# EAGLE design rj45-breakout-10.5.0 (EAGLE 9.6.1)
Assembly variants: NO_NMEA

## Sheet 1 of 2
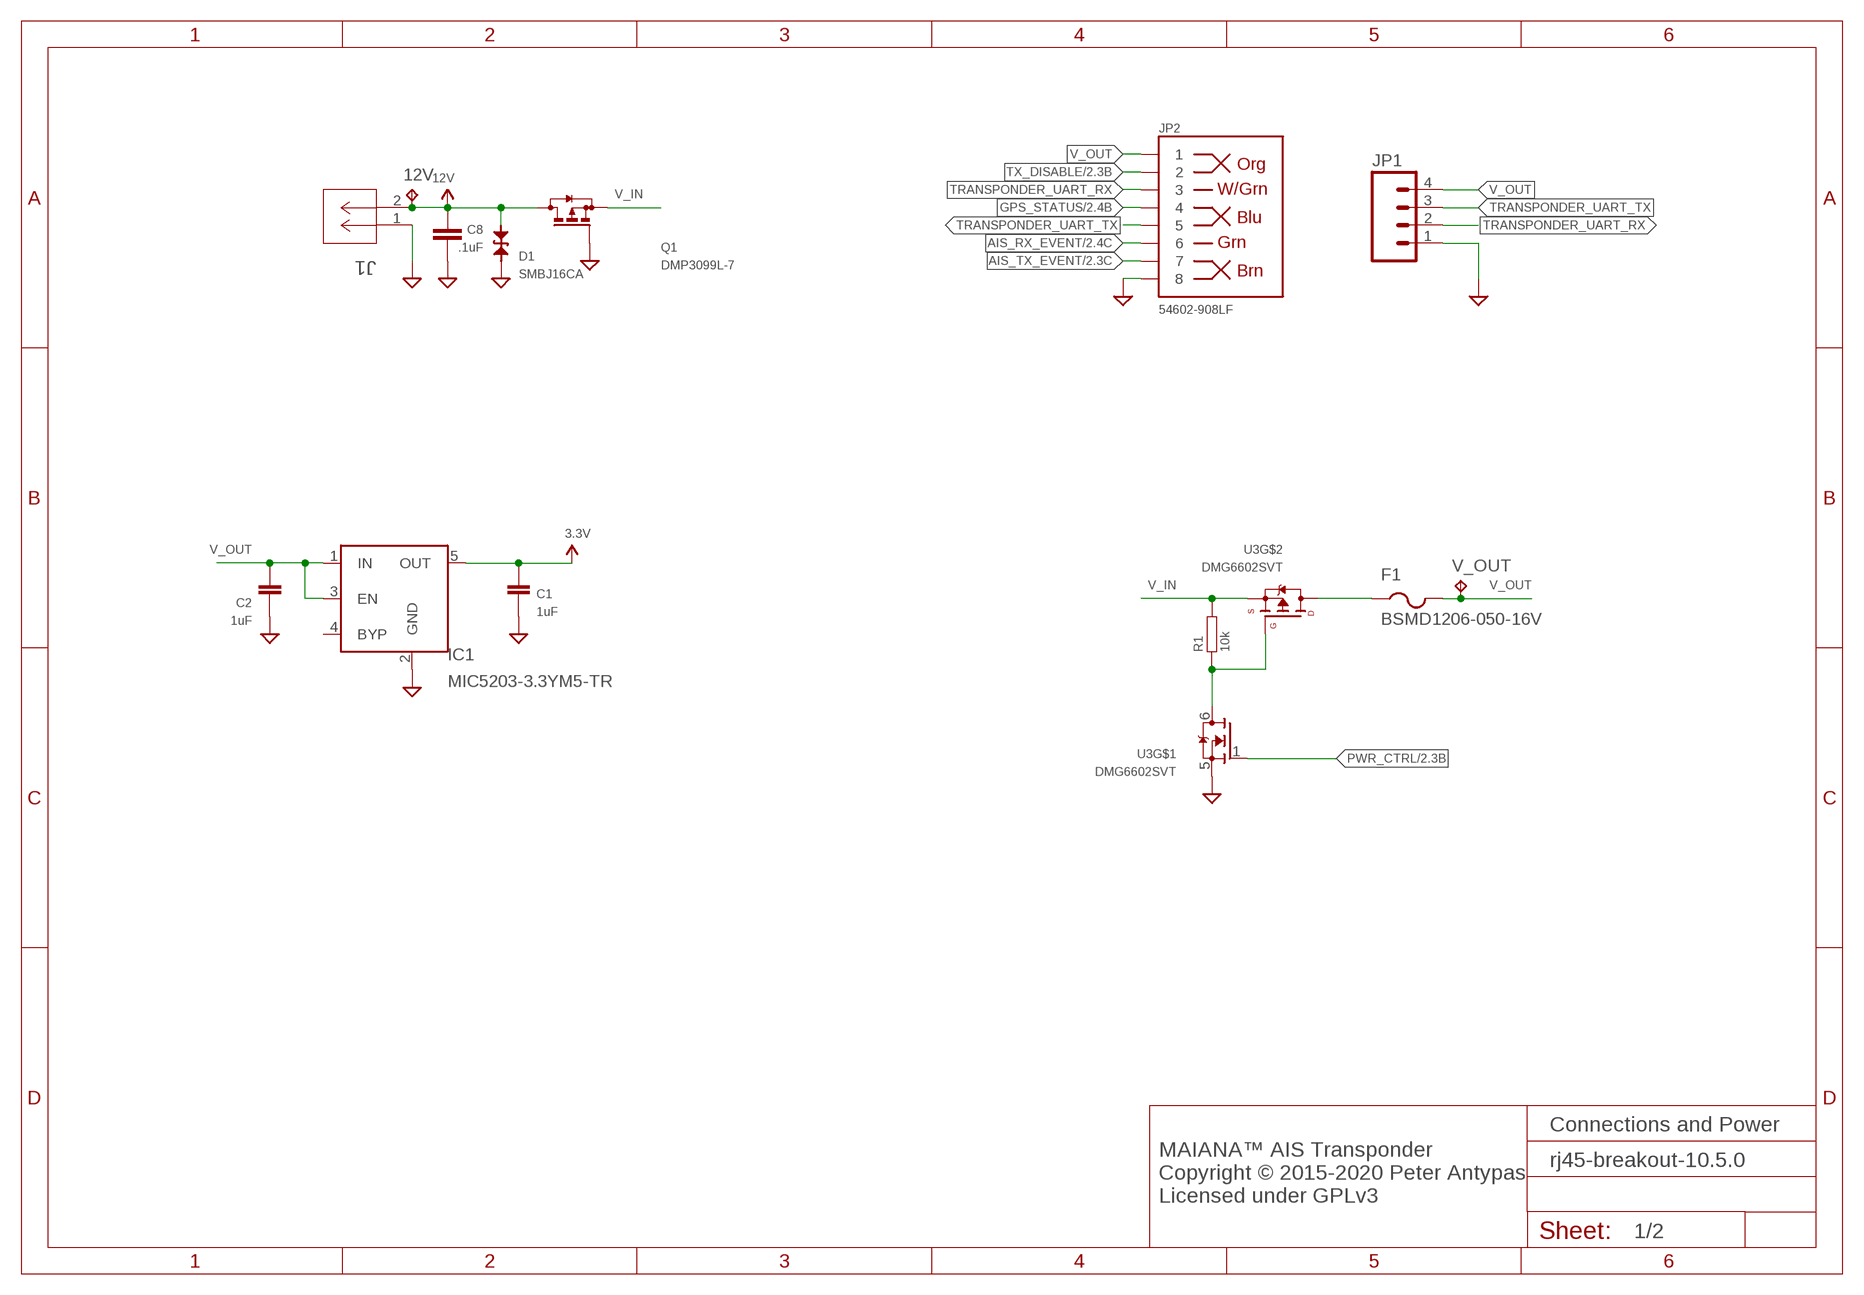
[diagram p0: schematic, sheet 1]

### Parts
12V  TPTP20R  [TP20R]
C1  1uF  CAPACITOR0603  [0603]
C2  1uF  CAPACITOR0603  [0603]
C8  .1uF  CAP0603-CAP  [0603-CAP]
D1  SMBJ16CA  DIODE-TVS-BIDIRSMB  [SMB-BIDIR]
F1  BSMD1206-050-16V  PTCFUSE-1206  [R1206]
IC1  MIC5203-3.3YM5-TR  MIC5219XX  [SOT23-5]
J1  OSTVN02A150  [CONN_OSTVN02A150_OST]
JP1  M04PTH  [1X04]
JP2  54602-908LF  RJ45-8PTH  [RJ45-8]
Q1  DMP3099L-7  BSS84  [SOT23]
R1  10k  RESISTOR0603  [0603]
U3  DMG6602SVT  [SOT23-6]
V_OUT  TPTP20R  [TP20R]

### Nets
3.3V: C1.P$1 IC1.5(OUT) ; also sheet 2
12V: 12V.TP C8.1 D1.A J1.2 Q1.3(D)
AIS_RX_EVENT: JP2.6 ; also sheet 2
AIS_TX_EVENT: JP2.7 ; also sheet 2
GND: C1.P$2 C2.P$2 C8.2 D1.C IC1.2(GND) J1.1 JP1.1 JP2.8 Q1.1(G) U3.5(S) ; also sheet 2
GPS_STATUS: JP2.4 ; also sheet 2
N$8: R1.P$1 U3.3(G) U3.6(D)
N$10: F1.1 U3.4(D)
PWR_CTRL: U3.1(G) ; also sheet 2
TRANSPONDER_UART_RX: JP1.2 JP2.3
TRANSPONDER_UART_TX: JP1.3 JP2.5
TX_DISABLE: JP2.2 ; also sheet 2
V_IN: Q1.2(S) R1.P$2 U3.2(S) ; also sheet 2
V_OUT: C2.P$1 F1.2 IC1.1(IN) IC1.3(EN) JP1.4 JP2.1 V_OUT.TP
Unconnected: IC1.4(BYP)

### Notes on the sheet
- Connections and Power
- MAIANA™ AIS Transponder
  Copyright © 2015-2020 Peter Antypas
  Licensed under GPLv3

## Sheet 2 of 2
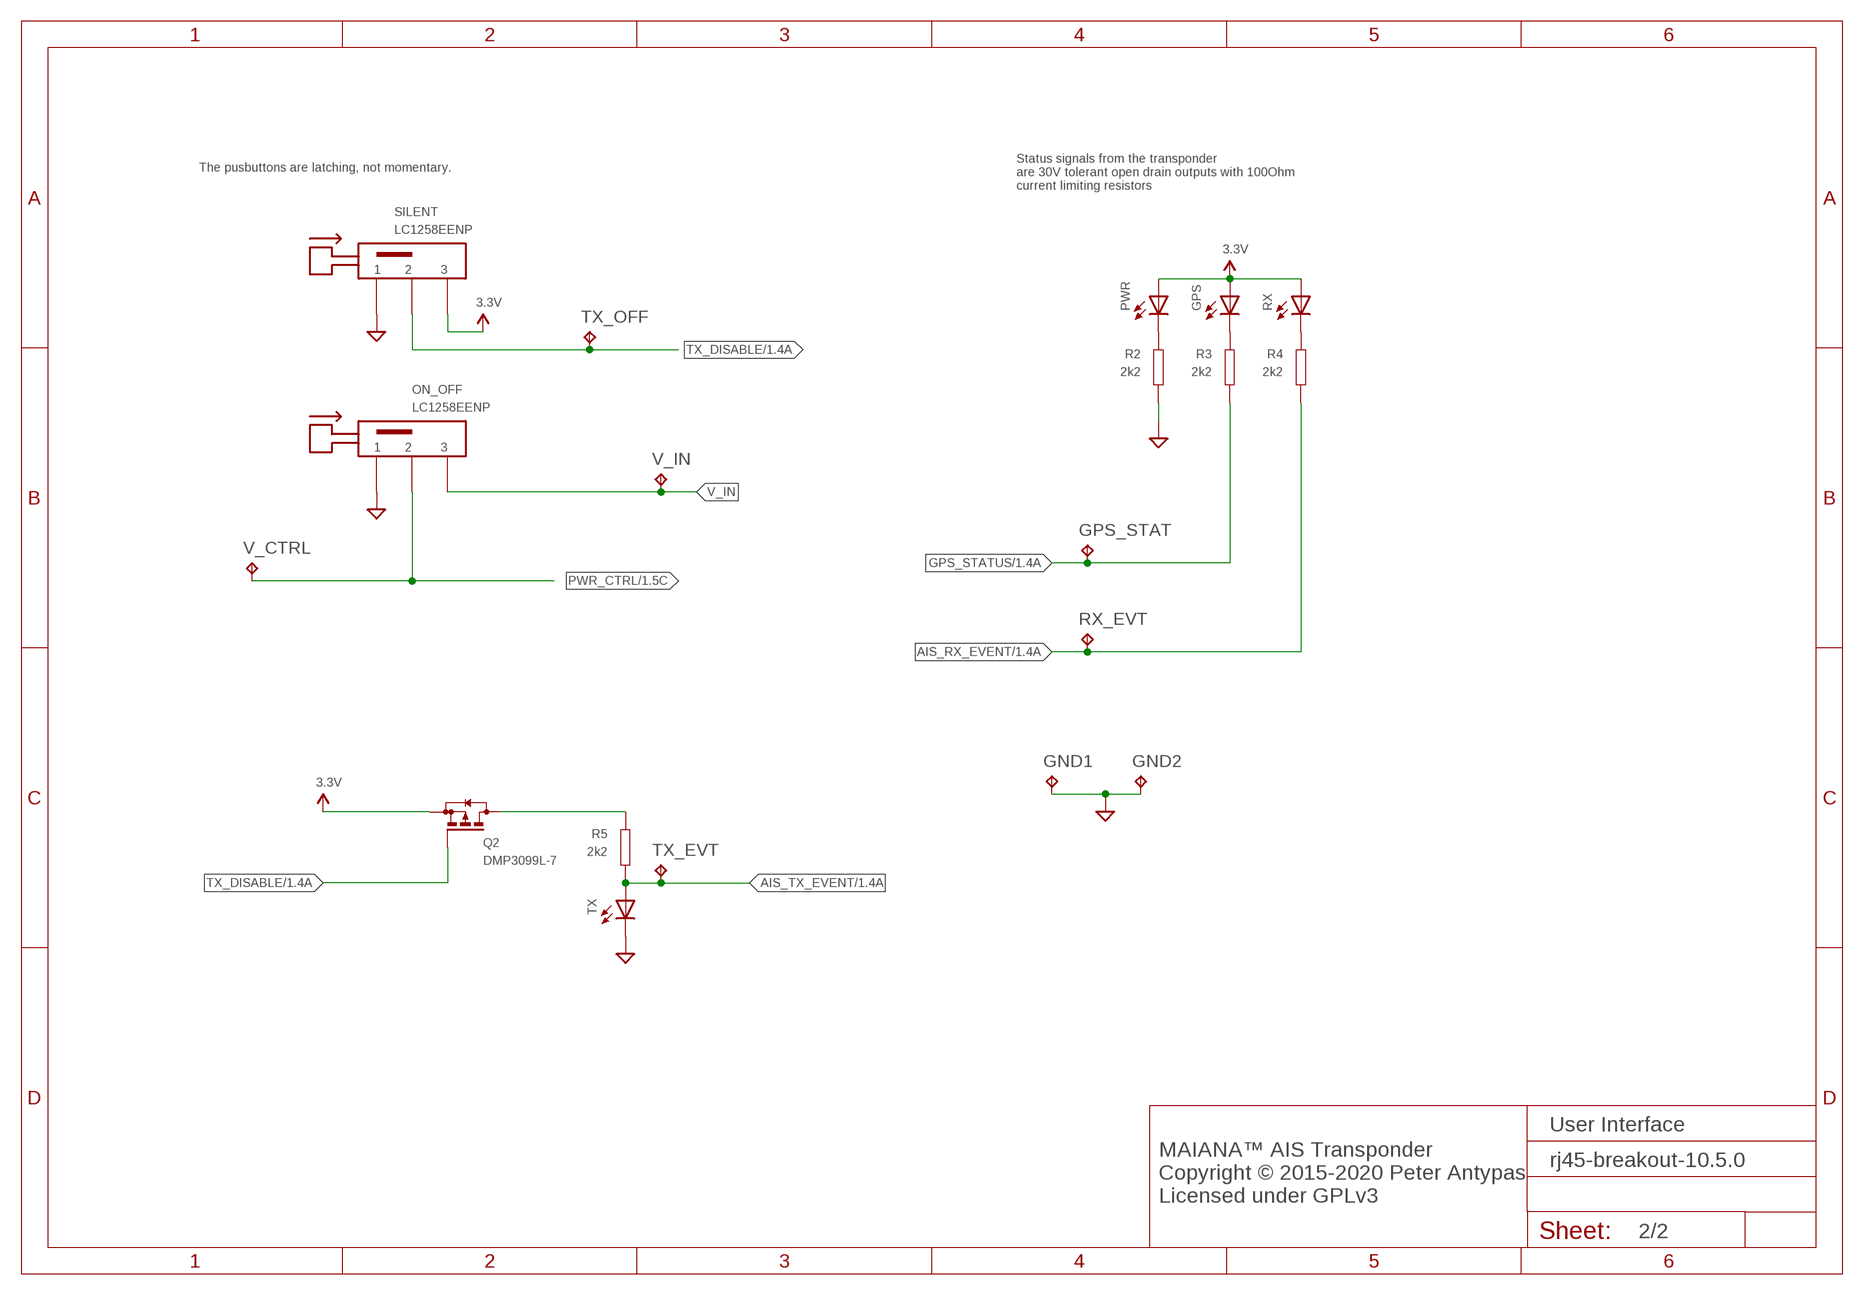
[diagram p1: schematic, sheet 2]

### Parts
GND1  TPTP20R  [TP20R]
GND2  TPTP20R  [TP20R]
GPS  LEDCHIPLED_1206  [CHIPLED_1206]
GPS_STAT  TPTP20R  [TP20R]
ON_OFF  LC1258EENP  LC1258XXNP  [LC1258XXNP]
PWR  LEDCHIPLED_1206  [CHIPLED_1206]
Q2  DMP3099L-7  BSS84  [SOT23]
R2  2k2  RESISTOR0603  [0603]
R3  2k2  RESISTOR0603  [0603]
R4  2k2  RESISTOR0603  [0603]
R5  2k2  RESISTOR0603  [0603]
RX  LEDCHIPLED_1206  [CHIPLED_1206]
RX_EVT  TPTP20R  [TP20R]
SILENT  LC1258EENP  LC1258XXNP  [LC1258XXNP]
TX  LEDCHIPLED_1206  [CHIPLED_1206]
TX_EVT  TPTP20R  [TP20R]
TX_OFF  TPTP20R  [TP20R]
V_CTRL  TPTP20R  [TP20R]
V_IN  TPTP20R  [TP20R]

### Nets
3.3V: GPS.A PWR.A Q2.2(S) RX.A SILENT.P$3 ; also sheet 1
AIS_RX_EVENT: R4.P$2 RX_EVT.TP ; also sheet 1
AIS_TX_EVENT: R5.P$2 TX.A TX_EVT.TP ; also sheet 1
GND: GND1.TP GND2.TP ON_OFF.P$1 R2.P$2 SILENT.P$1 TX.C ; also sheet 1
GPS_STATUS: GPS_STAT.TP R3.P$2 ; also sheet 1
N$2: PWR.C R2.P$1
N$3: GPS.C R3.P$1
N$4: R4.P$1 RX.C
N$6: Q2.3(D) R5.P$1
PWR_CTRL: ON_OFF.P$2 V_CTRL.TP ; also sheet 1
TX_DISABLE: Q2.1(G) SILENT.P$2 TX_OFF.TP ; also sheet 1
V_IN: ON_OFF.P$3 V_IN.TP ; also sheet 1

### Notes on the sheet
- The pusbuttons are latching, not momentary.
- Status signals from the transponder
  are 30V tolerant open drain outputs with 100Ohm 
  current limiting resistors
- User Interface
- MAIANA™ AIS Transponder
  Copyright © 2015-2020 Peter Antypas
  Licensed under GPLv3

## Library data of the parts
12V GND1 GND2 GPS_STAT RX_EVT TX_EVT TX_OFF V_CTRL V_IN V_OUT = testpad:TP: Test pad
C1 C2 = MyPassives:CAPACITOR: Standard SMD capacitor
C8 = SparkFun-Capacitors:CAP: Capacitor Standard 0603 ceramic capacitor, and 0.1" leaded capacitor.; PARTNO: GRM188R71E223KA01D
D1 = MyDiodes:DIODE-TVS-BIDIR: Bidirectional TVS diode
F1 = adafruit:PTCFUSE: PTC fuses, resettable thermistors
GPS PWR RX TX = led:LED: LED OSRAM: - CHIPLED LG R971, LG N971, LY N971, LG Q971, LY Q971, LO R971, LY R971 LH N974, LH R974 LS Q976, LO Q976, LY Q976 LO Q996 - Hyper CHIPLED LW Q18S LB Q993, LB Q99A, LB R99A - SideLED LS A670, LO A670, LY A670, LG A670, LP A670 LB A673, LV A673, LT A673, LW A673 LH A674 LY A675 LS A676, LA A676, LO A676, LY A676, LW A676 LS A679, LY A679, LG A679 - Hyper Micro SIDELED® LS Y876, LA Y876, LO Y876, LY Y876 LT Y87S - SmartLED LW L88C, LW L88S LB L89C, LB L89S, LG L890 LS L89K, LO L89K, LY L89K LS L896, LA L896, LO L896, LY L896 - TOPLED LS T670, LO T670, LY T670, LG T670, LP T670 LSG T670, LSP T670, LSY T670, LOP T670, LYG T670 LG T671, LOG T671, LSG T671 LB T673, LV T673, LT T673, LW T673 LH T674 LS T676, LA T676, LO T676, LY T676, LB T676, LH T676, LSB T676, LW T676 LB T67C, LV T67C, LT T67C, LS T67K, LO T67K, LY T67K, LW E67C LS E67B, LA E67B, LO E67B, LY E67B, LB E67C, LV E67C, LT E67C LW T67C LS T679, LY T679, LG T679 LS T770, LO T770, LY T770, LG T770, LP T770 LB T773, LV T773, LT T773, LW T773 LH T774 LS E675, LA E675, LY E675, LS T675 LS T776, LA T776, LO T776, LY T776, LB T776 LHGB T686 LT T68C, LB T68C - Hyper Mini TOPLED® LB M676 - Mini TOPLED Santana® LG M470 LS M47K, LO M47K, LY M47K Source: http://www.osram.convergy.de LUXEON: - LUMILED® LXK2-PW12-R00, LXK2-PW12-S00, LXK2-PW14-U00, LXK2-PW14-V00 LXK2-PM12-R00, LXK2-PM12-S00, LXK2-PM14-U00 LXK2-PE12-Q00, LXK2-PE12-R00, LXK2-PE12-S00, LXK2-PE14-T00, LXK2-PE14-U00 LXK2-PB12-K00, LXK2-PB12-L00, LXK2-PB12-M00, LXK2-PB14-N00, LXK2-PB14-P00, LXK2-PB14-Q00 LXK2-PR12-L00, LXK2-PR12-M00, LXK2-PR14-Q00, LXK2-PR14-R00 LXK2-PD12-Q00, LXK2-PD12-R00, LXK2-PD12-S00 LXK2-PH12-R00, LXK2-PH12-S00 LXK2-PL12-P00, LXK2-PL12-Q00, LXK2-PL12-R00 Source: www.luxeon.com KINGBRIGHT: KA-3528ASYC Source: www.kingbright.com
IC1 = v-reg-micrel:MIC5219XX: VOLTAGE REGULATOR; OC_FARNELL: unknown; OC_NEWARK: unknown
J1 = ost-2pin-contact:OSTVN02A150; BUILT_BY: EMA_Cory; COPYRIGHT: Copyright (C) 2018 Accelerated Designs. All rights reserved; MANUFACTURER_PART_NUMBER: OSTVN02A150; SOURCELIBRARY: On_Shore_Technology_2019-12-02; VENDOR: On Shore Technology Inc
JP1 = SparkFun-Connectors:M04: Header 4 Standard 4-pin 0.1" header. Use with straight break away headers (SKU : PRT-00116), right angle break away headers (PRT-00553), swiss pins (PRT-00743), machine pins (PRT-00117), and female headers (PRT-00115). Molex polarized connector foot print use with SKU : PRT-08231 with associated crimp pins and housings. 1MM SMD Version SKU: PRT-10208
JP2 = SparkFun-Connectors:RJ45-8: RJ45 Jack Simple RJ45, 8-pin connection - connector for common Cat5, Cat5e, and Cat6 Ethernet cables. Footprint not yet proven in production. Connector sku is PRT-00643; Breakout PCB sku is BOB-00716.; PROD_ID: CONN-08506; VALUE: RJ45
ON_OFF SILENT = e-switch:LC1258XXNP: E-Switch SPDT pushbutton
Q1 Q2 = transistor-small-signal:BSS84: P-CHANNEL MOS FET
R1-R5 = MyPassives:RESISTOR: Standard SMD resistor
U3 = diodesinc:DMG6602SVT: N/P channel MOSFET array

## Board
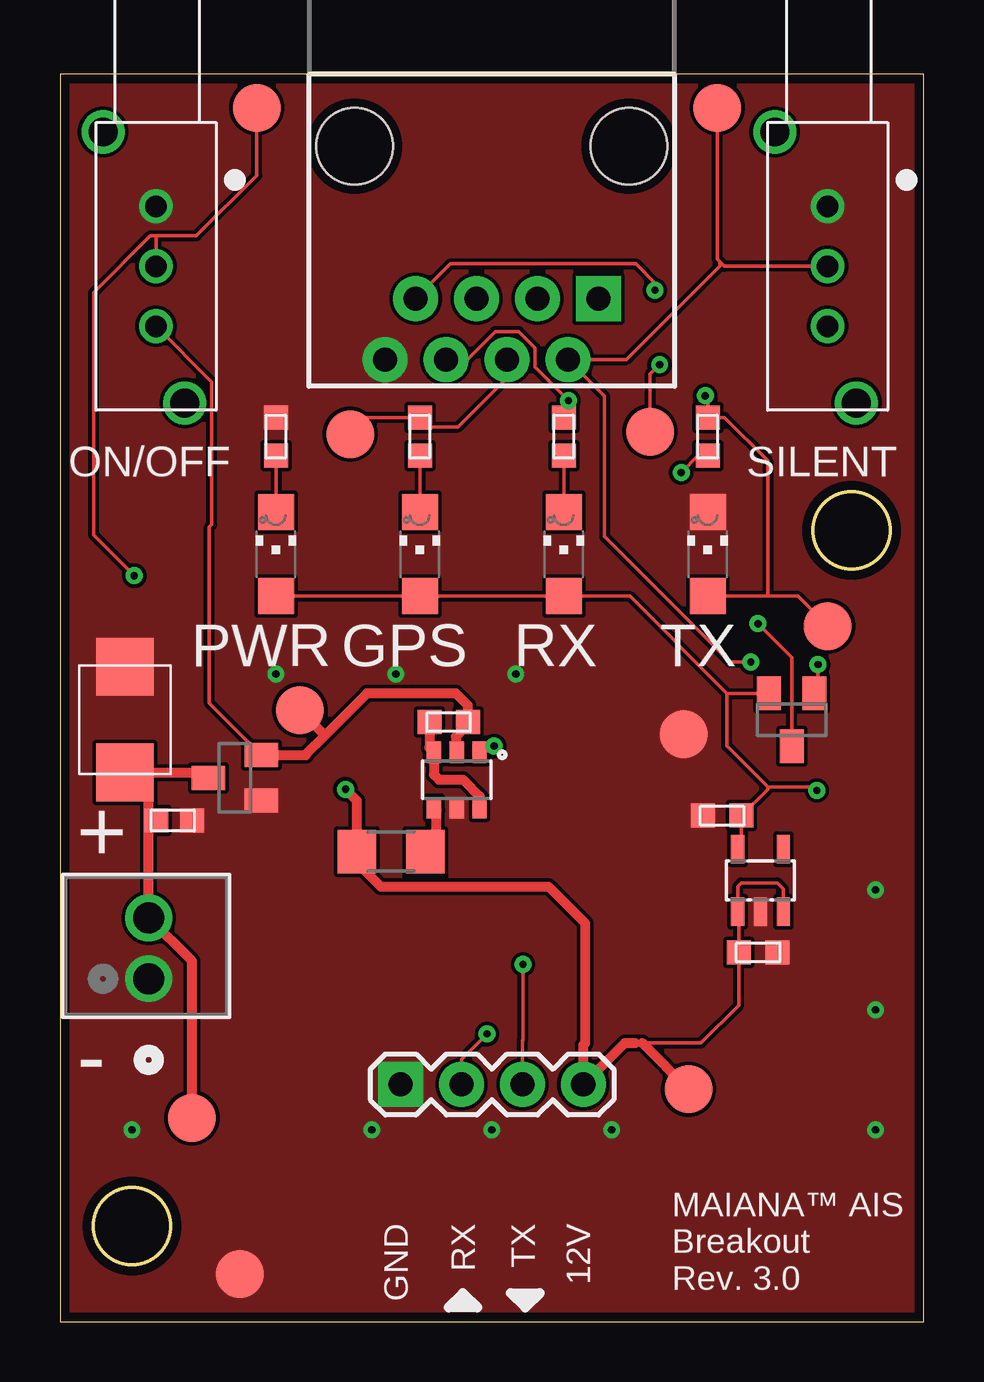
[diagram p2: board, top side]
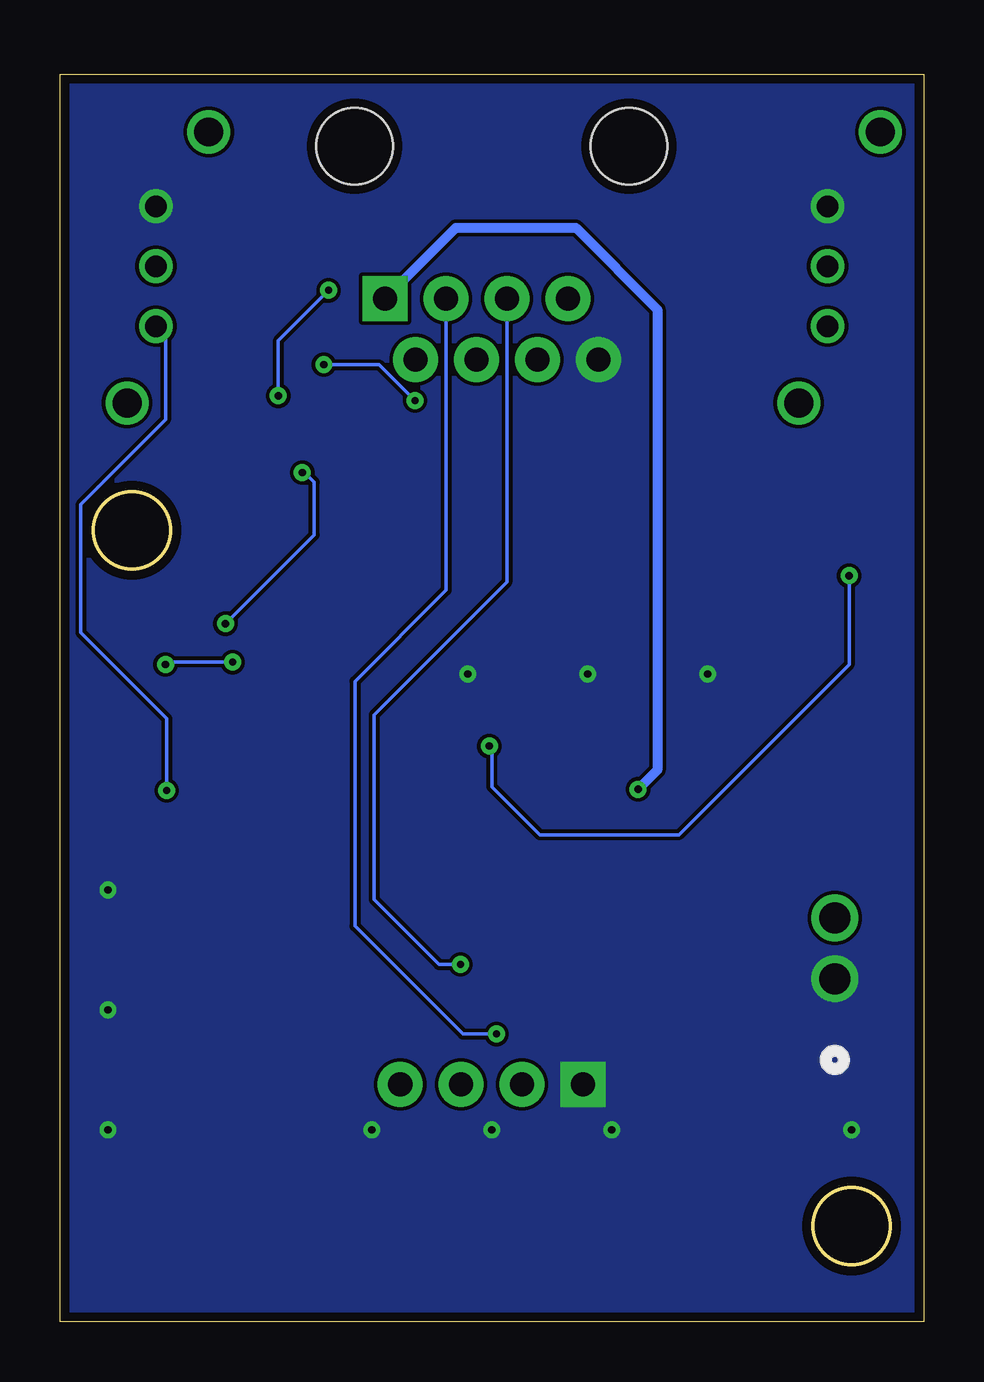
[diagram p3: board, bottom side, seen from below]

Size 36 x 52 mm. Coordinates in mm from the lower left corner, seen from the top.
Outline: 0,0 36,0 36,52 0,52 0,0
Outline: circle at 3,4 radius 1.6
Outline: circle at 33,33 radius 1.6
Copper layers (1*16): Top 0.035mm / dielectric 1.5mm / Bottom 0.035mm
Design rules "default *": minimum track width 6mil, minimum drill 0.3mm, track to track 6mil, track to pad 6mil, pad to pad 6mil, via to via 6mil, smd to smd 0mil, copper to edge 15mil, drill to drill 6mil, minimum pad ring 10mil, minimum via ring 8mil, stop-mask expansion 4mil, vias tented up to drill 20mil, thermal gap 10mil

### Footprints (pad centres in the part's own frame; a part is rotated, then mirrored left to right if it is on the bottom)
TP20R = smd 2 x 2: TP 0,0
0603 = smd 1 x 1: P$1 -0.8,0; P$2 0.8,0
0603-CAP = smd 1 x 1: 1 -0.7,0; 2 0.8,0
SMB-BIDIR = smd 2.4 x 2.4: A 2.2,0; C -2.2,0
R1206 = smd 1.6 x 1.803: 1 -1.422,0; 2 1.422,0
CHIPLED_1206 = smd 1.5 x 1.5: A 0,-1.75; C 0,1.75
SOT23-5 = smd 0.55 x 1.2: 1 -0.95,-1.3; 2 0,-1.3; 3 0.95,-1.3; 4 0.95,1.3; 5 -0.95,1.3
CONN_OSTVN02A150_OST = drill 1.295 pad 1.803: 1 0,0; 2 2.54,0
1X04 = drill 1.016 pad 1.88 square: 1 0,0 | drill 1.016 pad 1.88: 2 2.54,0; 3 5.08,0; 4 7.62,0
RJ45-8 = drill 1 pad 1.88 square: 1 -4.445,6.35 | drill 1 pad 1.88: 2 -3.175,8.89; 3 -1.905,6.35; 4 -0.635,8.89; 5 0.635,6.35; 6 1.905,8.89; 7 3.175,6.35; 8 4.445,8.89 | hole 3.2: -5.715,0; 5.715,0
LC1258XXNP = drill 0.9: P$1 2.5,0; P$2 0,0; P$3 -2.5,0 | drill 1.2: P$4 -5.7,-1.2; P$5 5.6,2.2
SOT23 = smd 1 x 1.4: 1 -0.95,-1.1; 2 0.95,-1.1; 3 0,1.1
SOT23-6 = smd 0.6 x 0.9: 1 -0.95,-1.15; 2 0,-1.15; 3 0.95,-1.15; 4 0.95,1.15; 5 0,1.15; 6 -0.95,1.15

### Placement (x,y rotation side)
12V  5.5,8.5 0 top
C1  27.6,21.1 180 top
C2  29.1,15.4 0 top
C8  4.7,20.9 0 top
D1  2.7,25.1 270 top
F1  13.8,19.6 180 top
GND1  7.5,2 0 top
GND2  26,24.5 0 top
GPS  15,32 0 top
GPS_STAT  12.1,37 0 top
IC1  29.2,18.4 0 top
J1  3.7,14.3 90 top
JP1  14.2,9.9 0 top
JP2  18,49 180 top
ON_OFF  4,44 90 top
PWR  9,32 0 top
Q1  7.29,22.68 90 top
Q2  30.5,25.1 180 top
R1  16.2,25 0 top
R2  9,36.9 90 top
R3  15,36.9 90 top
R4  21,36.9 90 top
R5  27,36.9 90 top
RX  21,32 0 top
RX_EVT  24.6,37.1 0 top
SILENT  32,44 90 top
TX  27,32 0 top
TX_EVT  32,29 0 top
TX_OFF  27.4,50.6 0 top
U3  16.54,22.59 180 top
V_CTRL  8.2,50.6 0 top
V_IN  10,25.5 0 top
V_OUT  26.2,9.7 0 top

### Tracks (layer width: path | path; a pad name or v marks a point on that pad's centre or on a via)
3.3V  (via drill 0.3)
  Top 0.152: PWR.A GPS.A RX.A 23.75,30.25 27.8,26.2 | 27.8,26.2 Q2.2 | v31.55,22.15 31.4,22.3 29.5,22.3 | 29.5,22.3 27.8,24 27.8,26.2 | IC1.5 28.4,19.85 C1.P$1 29.5,22.2 29.5,22.3
  Bottom 0.152: SILENT.P$3 31.6,41.1 31.6,37.6 35.13,34.07 35.13,28.73 31.55,25.15 v31.55,22.15
12V
  Top 0.406: 3.7,20.9 J1.2 5.5,15.04 12V.TP | 3.7,20.9 3.7,21.9 D1.A 5.97,22.9 Q1.3 | C8.1 3.7,20.9
AIS_RX_EVENT  (via drill 0.3)
  Top 0.152: v25,39.9 24.6,39.5 RX_EVT.TP | R4.P$2 21.2,37.9 v21.2,38.4 19.8,39.8 19.8,40.59 19.12,41.28 18.15,41.28 16.98,40.11 JP2.6
  Bottom 0.152: v25,39.9 22.7,39.9 v21.2,38.4
AIS_TX_EVENT  (via drill 0.3)
  Top 0.152: TX.A 29.5,30.25 | 29.5,30.25 30.75,30.25 TX_EVT.TP | 29.5,30.25 29.5,35.9 27.7,37.7 R5.P$2 27,38.5 v26.9,38.6 | JP2.7 16.27,44.1 24,44.1 24.8,43.3 v24.8,43
  Bottom 0.152: v24.8,43 26.9,40.9 v26.9,38.6
GND  (via drill 0.3)
  other vias: 34,13 34,8 23,8 18,8 13,8 3,8 34,18 19,27 14,27 9,27
  pour Top (no thermals): -2,54 38,54 38,-2 -2,-2
  pour Bottom (no thermals): -3,55 39,55 39,-4 -3,-4
GPS_STATUS
  Top 0.152: JP2.4 18.64,39.34 16.6,37.3 15.4,37.3 R3.P$2 12.8,37.7 GPS_STAT.TP
N$2
  Top 0.152: R2.P$1 PWR.C
N$3
  Top 0.152: R3.P$1 GPS.C
N$4
  Top 0.152: R4.P$1 RX.C
N$6  (via drill 0.3)
  Top 0.152: Q2.3 30.5,27.7 v29.1,29.1 | v25.9,35.4 26.6,36.1 R5.P$1
  Bottom 0.152: v29.1,29.1 25.4,32.8 25.4,35 25.8,35.4 v25.9,35.4
N$8
  Top 0.406: U3.6 17.49,21.91 16.8,22.6 15.8,22.6 15.59,22.81 U3.3 15.4,23.93 R1.P$1
N$10
  Top 0.406: U3.4 15.7,21.33 15.7,20.08 F1.1
PWR_CTRL  (via drill 0.3)
  Top 0.152: U3.1 17.49,23.8 17.9,23.8 v18.1,24 | 4,45.27 3.77,45.27 1.4,42.9 1.4,32.8 v3.1,31.1 | 4,45.27 5.69,45.27 8.2,47.78 V_CTRL.TP | ON_OFF.P$2 4,45.27
  Bottom 0.152: v3.1,31.1 3.1,27.4 10.2,20.3 16,20.3 18,22.3 18,23.9 v18.1,24
TRANSPONDER_UART_RX  (via drill 0.3)
  Top 0.152: JP1.2 16.74,10.94 v17.8,12
  Bottom 0.152: JP2.3 19.91,30.5 23.7,26.7 23.7,16.5 19.2,12 v17.8,12
TRANSPONDER_UART_TX  (via drill 0.3)
  Top 0.152: v19.3,14.9 19.3,11.76 19.28,11.73 JP1.3
  Bottom 0.152: JP2.5 17.36,30.84 22.9,25.3 22.9,17.6 20.2,14.9 v19.3,14.9
TX_DISABLE  (via drill 0.3)
  Top 0.152: 27.5,44.2 27.5,44 23.61,40.11 JP2.2 22.7,38.59 22.7,32.73 27.93,27.5 v28.8,27.5 | TX_OFF.TP 27.4,44.3 27.5,44.2 | SILENT.P$2 27.7,44 27.5,44.2 | Q2.1 31.6,26.2 v31.6,27.4
  Bottom 0.152: v28.8,27.5 31.5,27.5 v31.6,27.4
V_IN
  Top 0.152: Q1.2 6.23,25.79 6.23,33.13 6.33,33.23 6.33,39.17 ON_OFF.P$3
  Top 0.406: 11.05,24.45 10.24,23.64 10.26,23.63 Q1.2 | V_IN.TP 11.05,24.45 | U3.2 16.5,23.78 16.5,24.4 17,24.9 R1.P$2 17,25.7 16.5,26.2 12.8,26.2 11.05,24.45
V_OUT  (via drill 0.3)
  Top 0.152: 23.98,11.62 24.27,11.62 26.73,11.62 28.3,13.2 C2.P$1 28.3,17.05 IC1.1 28.25,18.15 28.4,18.3 29.9,18.3 30.15,18.05 IC1.3
  Top 0.406: V_OUT.TP 24.27,11.62 | v11.9,22.2 12.38,21.72 F1.2 12.38,19.14 13.38,18.14 20.36,18.14 21.9,16.6 21.9,11.62 21.82,11.54 JP1.4 23.55,11.62 23.98,11.62
  Bottom 0.406: JP2.1 19.5,45.6 14.5,45.6 11.1,42.2 11.1,23 v11.9,22.2

### Text on the board
tNames: ON/OFF | SILENT | + | - | MAIANA™ AIS / Breakout / Rev. 3.0 | GND | RX | TX | 12V